# EAGLE schematic 12VPart (EAGLE 9.6.2)
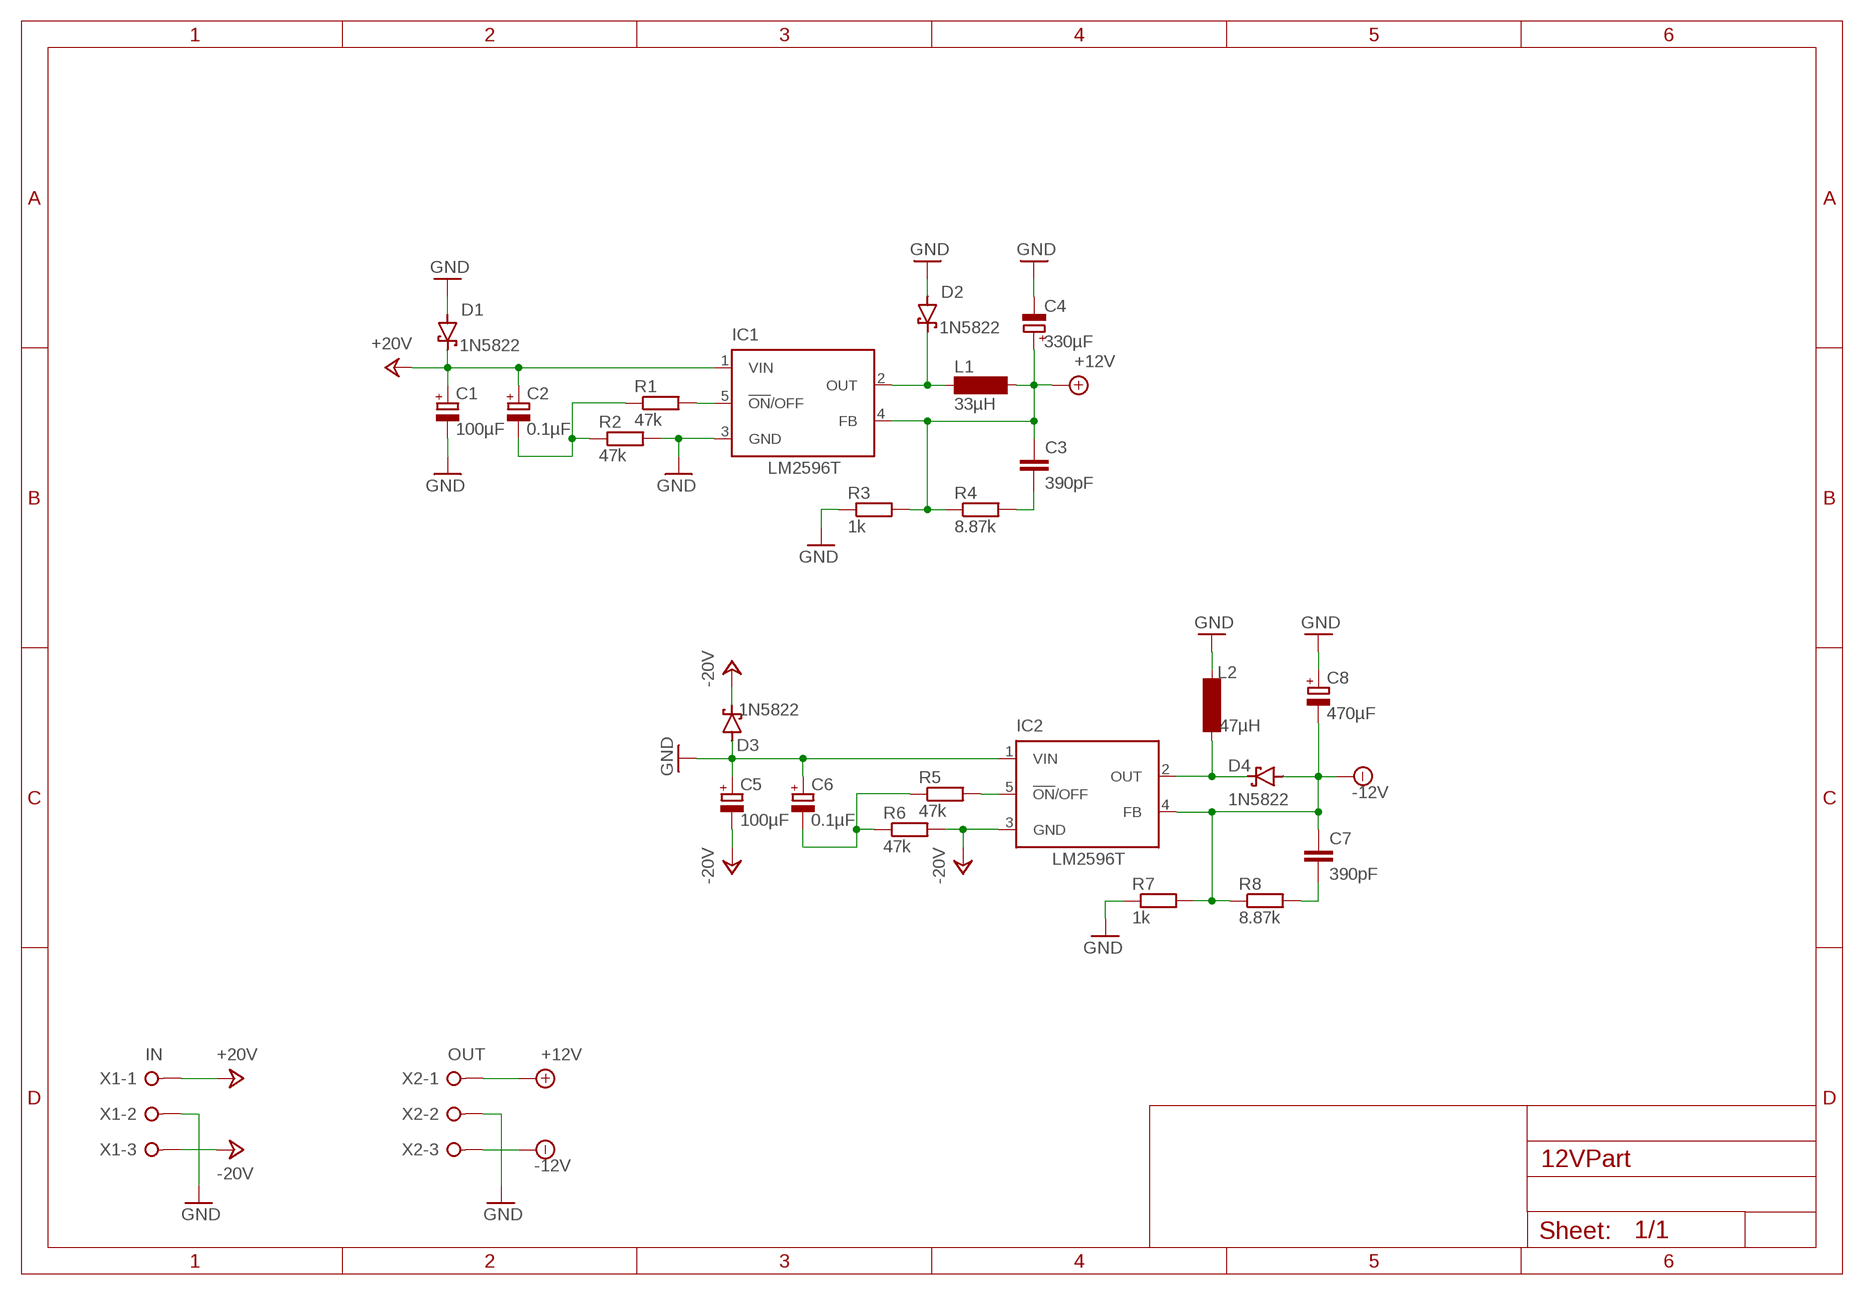
[diagram p0: schematic, sheet 1]

## Parts
C1  100µF  CPOL-EUE2.5-6  [E2,5-6]
C2  0.1µF  CPOL-EUE1.8-4  [E1,8-4]
C3  390pF  C-EU050-024X044  [C050-024X044]
C4  330µF  CPOL-EUE3.5-8  [E3,5-8]
C5  100µF  CPOL-EUE2.5-6  [E2,5-6]
C6  0.1µF  CPOL-EUE1.8-4  [E1,8-4]
C7  390pF  C-EU050-024X044  [C050-024X044]
C8  470µF  CPOL-EUE3.5-8  [E3,5-8]
D1  1N5822  SCHOTTKY-DIODEC4111-15  [C4111-15]
D2  1N5822  SCHOTTKY-DIODEC4111-15  [C4111-15]
D3  1N5822  SCHOTTKY-DIODEC4111-15  [C4111-15]
D4  1N5822  SCHOTTKY-DIODEC4111-15  [C4111-15]
IC1  LM2596T  [T05D]
IC2  LM2596T  [T05D]
L1  33µH  SD12-680  [SD12-680]
L2  47µH  SD12-680  [SD12-680]
R1  47k  R-EU_0207/10  [0207/10]
R2  47k  R-EU_0207/10  [0207/10]
R3  1k  R-EU_0207/10  [0207/10]
R4  8.87k  R-EU_0207/10  [0207/10]
R5  47k  R-EU_0207/10  [0207/10]
R6  47k  R-EU_0207/10  [0207/10]
R7  1k  R-EU_0207/10  [0207/10]
R8  8.87k  R-EU_0207/10  [0207/10]
X1  IN  W237-03P  [W237-133]
X2  OUT  W237-03P  [W237-133]

## Nets
+12V: C3.1 C4.+ IC1.4(FB) L1.2 R3.2 R4.1 X2.1
+24V: C1.+ C2.+ D1.C IC1.1(VIN) X1.1 ; supply symbol labelled +20V
-12V: C7.1 C8.- D4.A IC2.4(FB) R7.2 R8.1 X2.3
-24V: C5.- D3.C IC2.3(GND) R6.2 X1.3 ; supply symbol labelled -20V
GND: C1.- C4.- C5.+ C6.+ C8.+ D1.A D2.A D3.A IC1.3(GND) IC2.1(VIN) L2.2 R2.2 R3.1 R7.1 X1.2 X2.2
N$1: C3.2 R4.2
N$2: D4.C IC2.2(OUT) L2.1
N$3: D2.C IC1.2(OUT) L1.1
N$4: IC1.5(!ON!/OFF) R1.2
N$5: C7.2 R8.2
N$6: C2.- R1.1 R2.1
N$7: IC2.5(!ON!/OFF) R5.2
N$8: C6.- R5.1 R6.1

## Library data of the parts
C1 C2 C4-C6 C8 = rcl:CPOL-EU: POLARIZED CAPACITOR, European symbol; SPICEPREFIX: C
C3 C7 = rcl:C-EU: CAPACITOR, European symbol; SPICEPREFIX: C
D1-D4 = diode:SCHOTTKY-DIODE: Schottky Diode
IC1 IC2 = national-semiconductor:LM2596: SIMPLE SWITCHER® Power Converter 150 kHz 3A Step-Down Voltage Regulator Source: http://www.national.com/ds/LM/LM2596.pdf; MPN: LM2596T-ADJ/LF02; OC_FARNELL: 9494162; OC_NEWARK: 65K5910
L1 L2 = inductor-neosid:SD12: INDUCTOR nominal inductance; MF: BUSSMANN; MPN: SD12-680; OC_FARNELL: unknown; OC_NEWARK: 19K7201
R1-R8 = rcl:R-EU_: RESISTOR, European symbol; SPICEPREFIX: R
X1 X2 = con-wago-508:W237-03P: WAGO SREW CLAMP; OC_FARNELL: unknown; OC_NEWARK: unknown